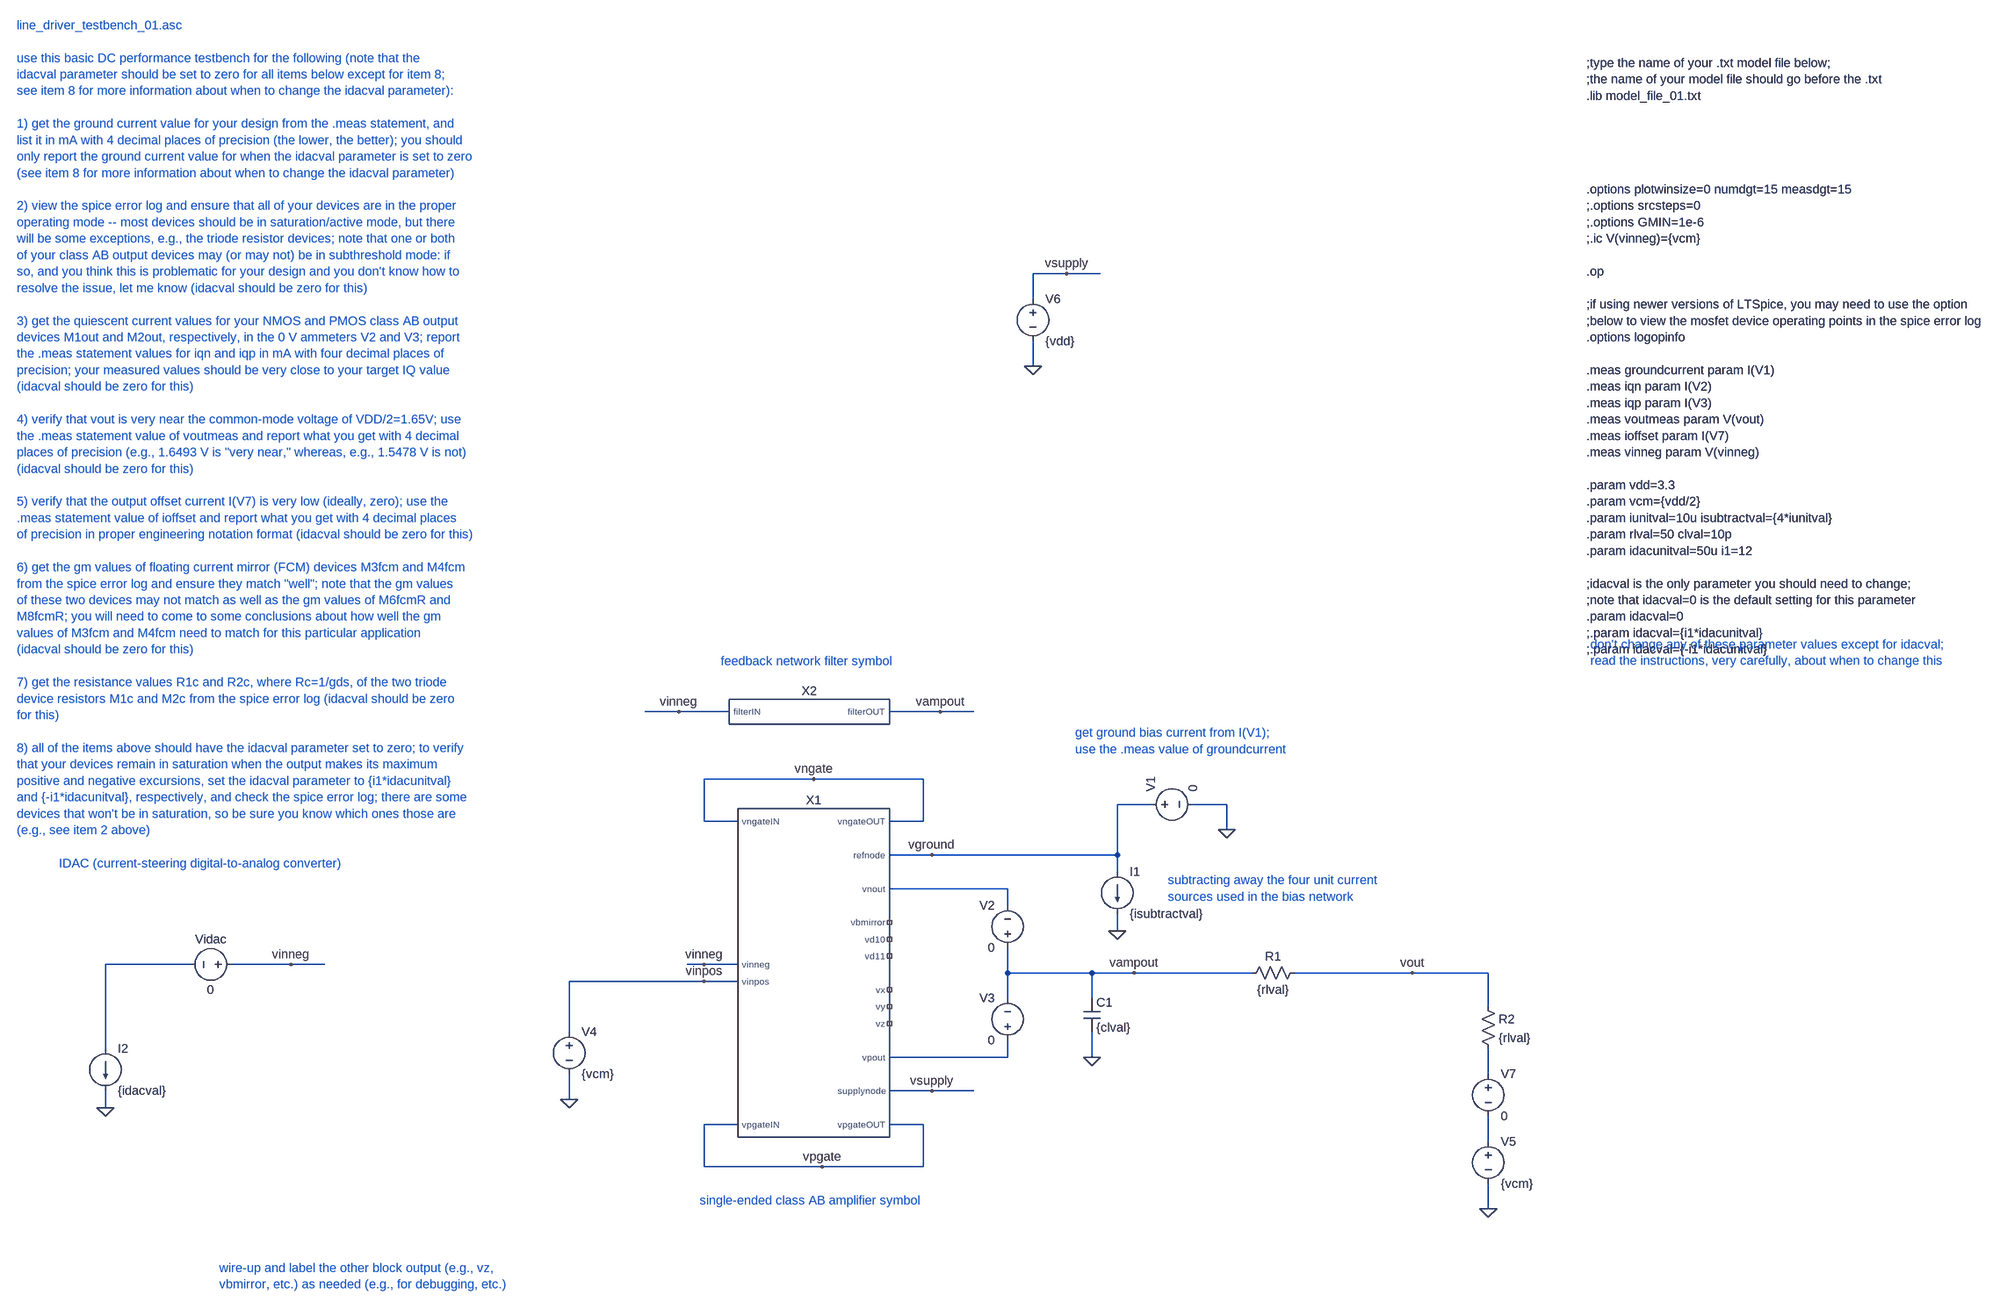
[diagram p0: schematic line_driver_testbench_01.asc]
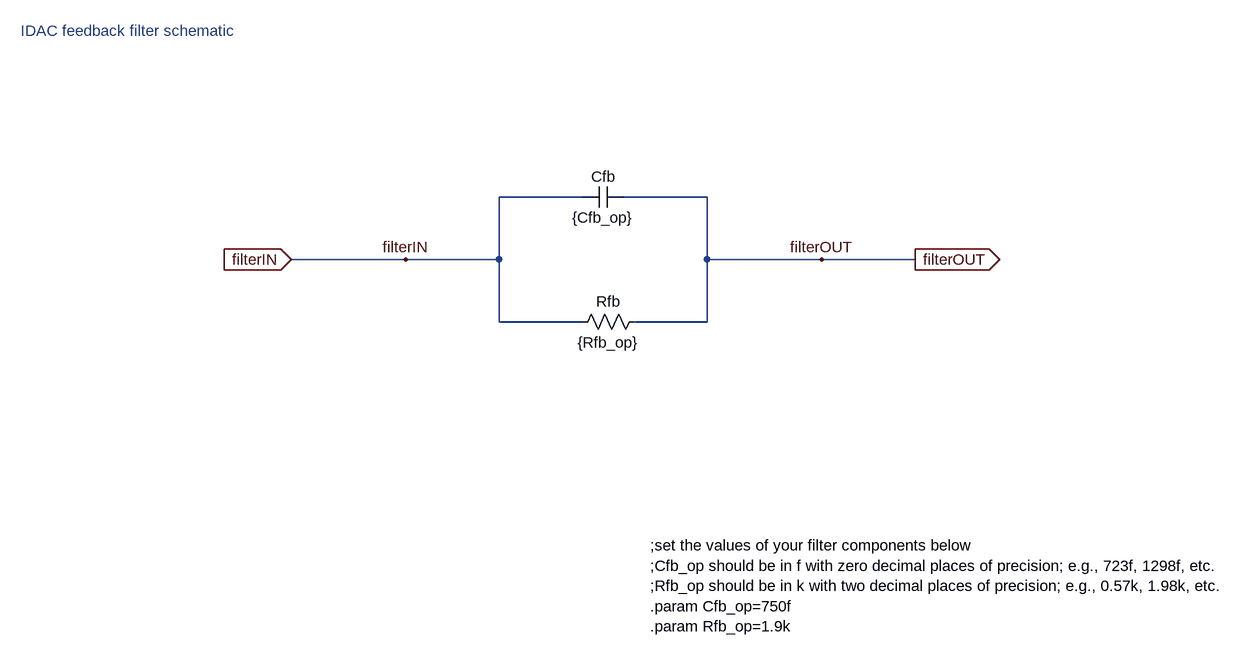
[diagram p1: sub-circuit fdbk_filter_schematic.asc]
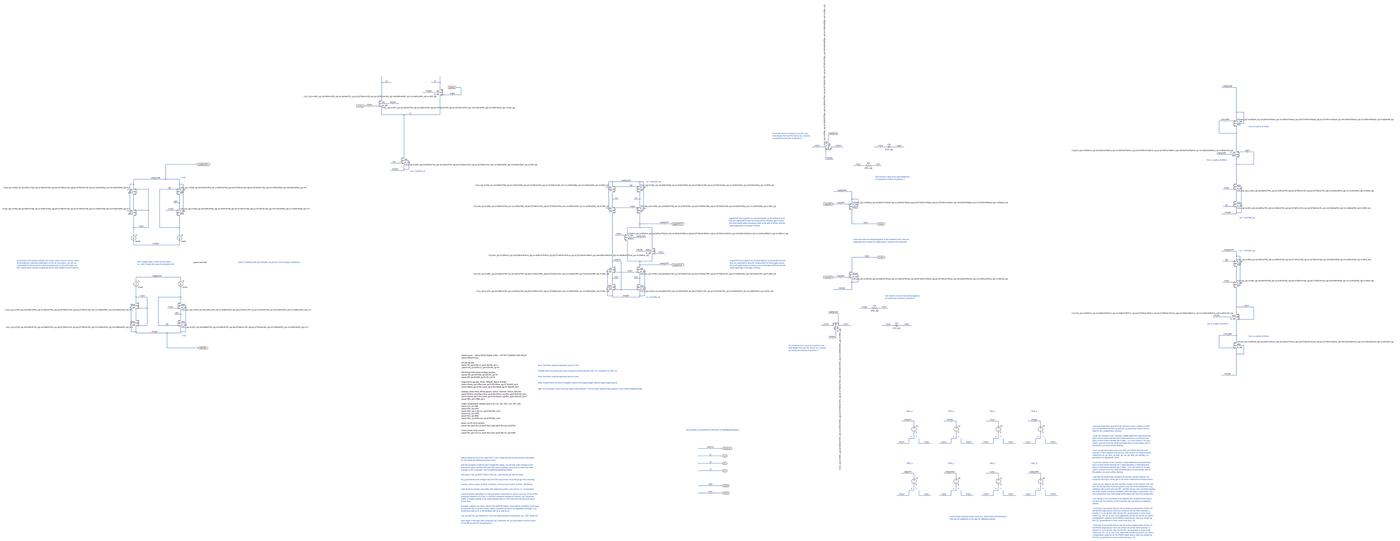
[diagram p2: sub-circuit amp_schematic_typeb_nmos_diff_pair.asc, whole sheet]
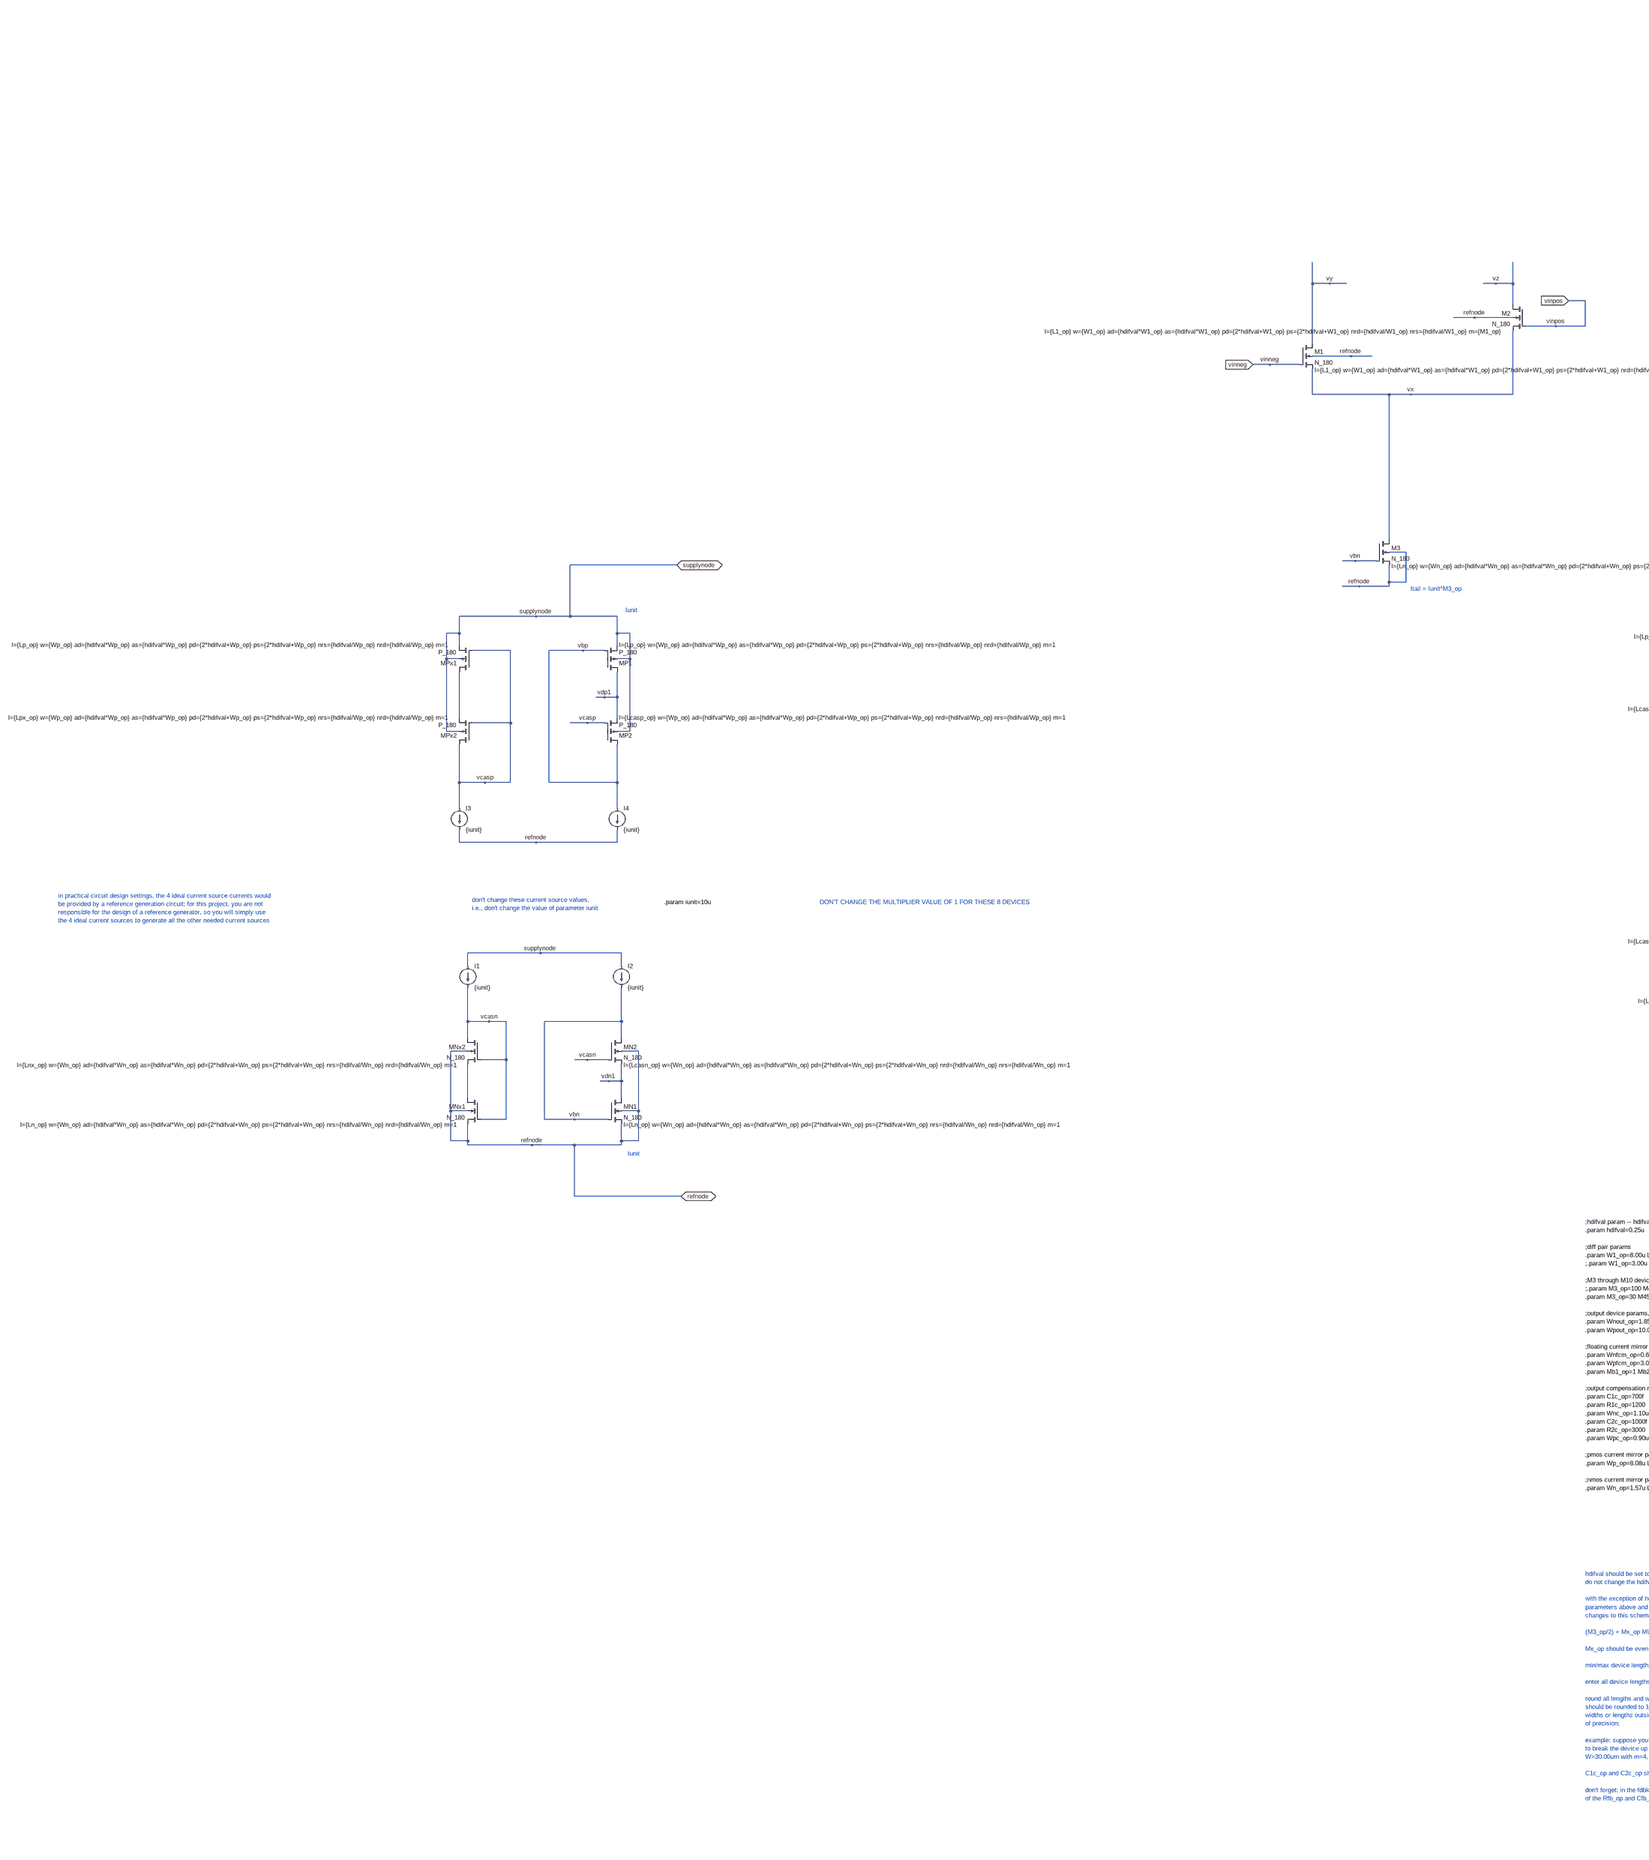
[diagram p3: sub-circuit amp_schematic_typeb_nmos_diff_pair.asc, part, row 1 of 1, column 1 of 3]
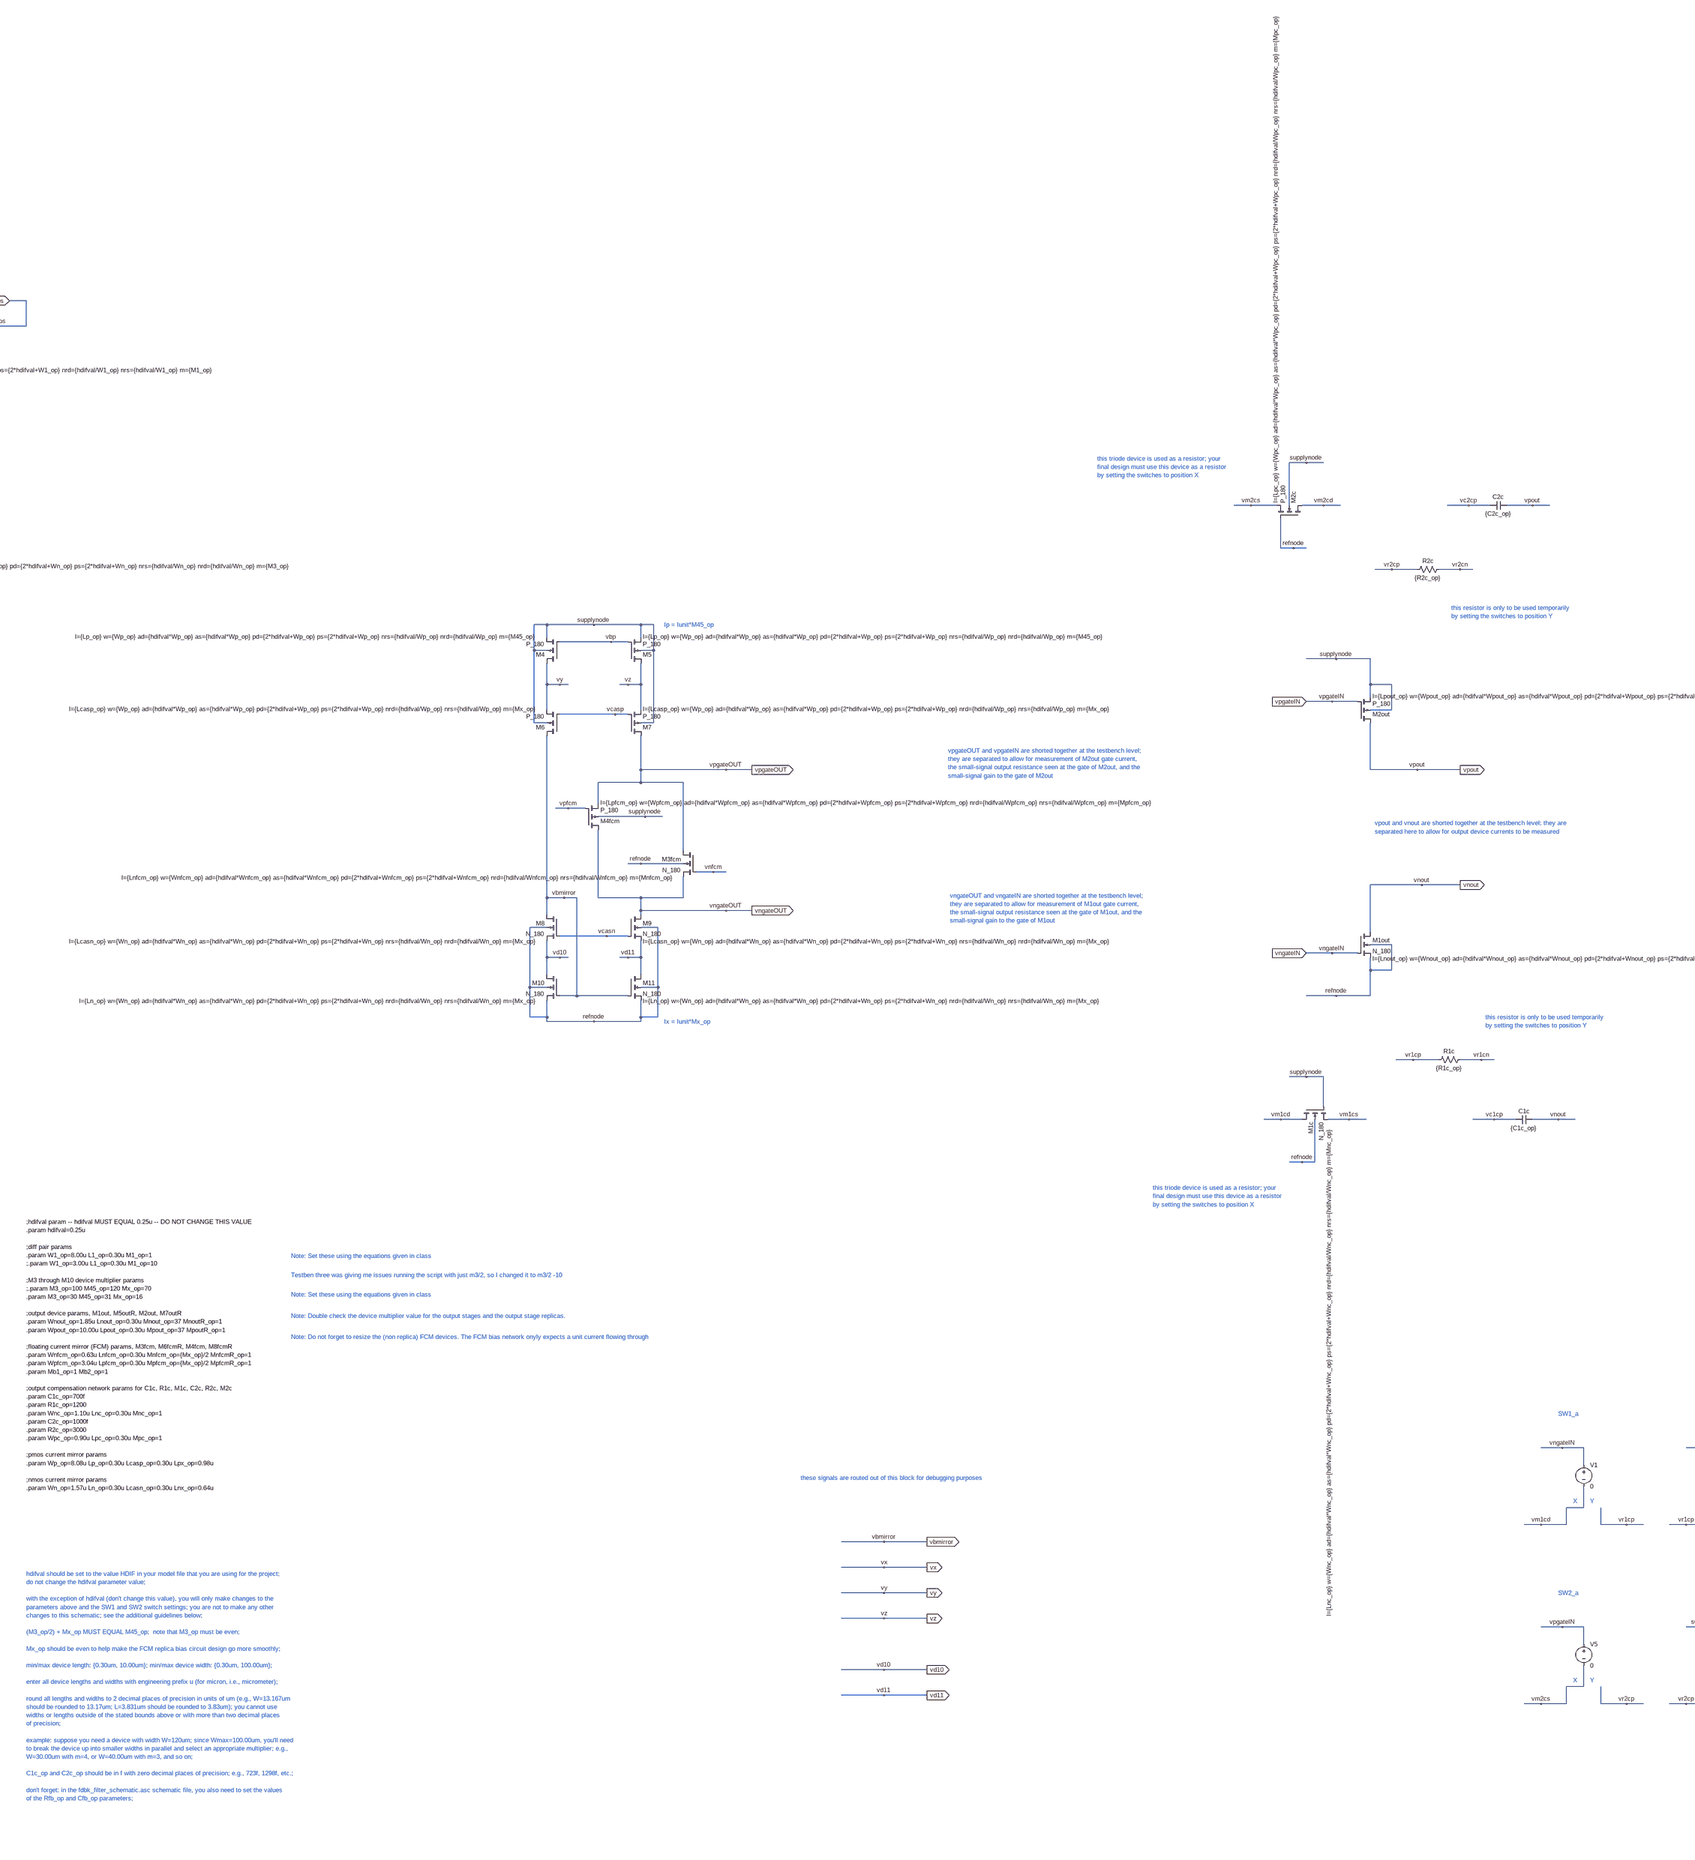
[diagram p4: sub-circuit amp_schematic_typeb_nmos_diff_pair.asc, part, row 1 of 1, column 2 of 3]
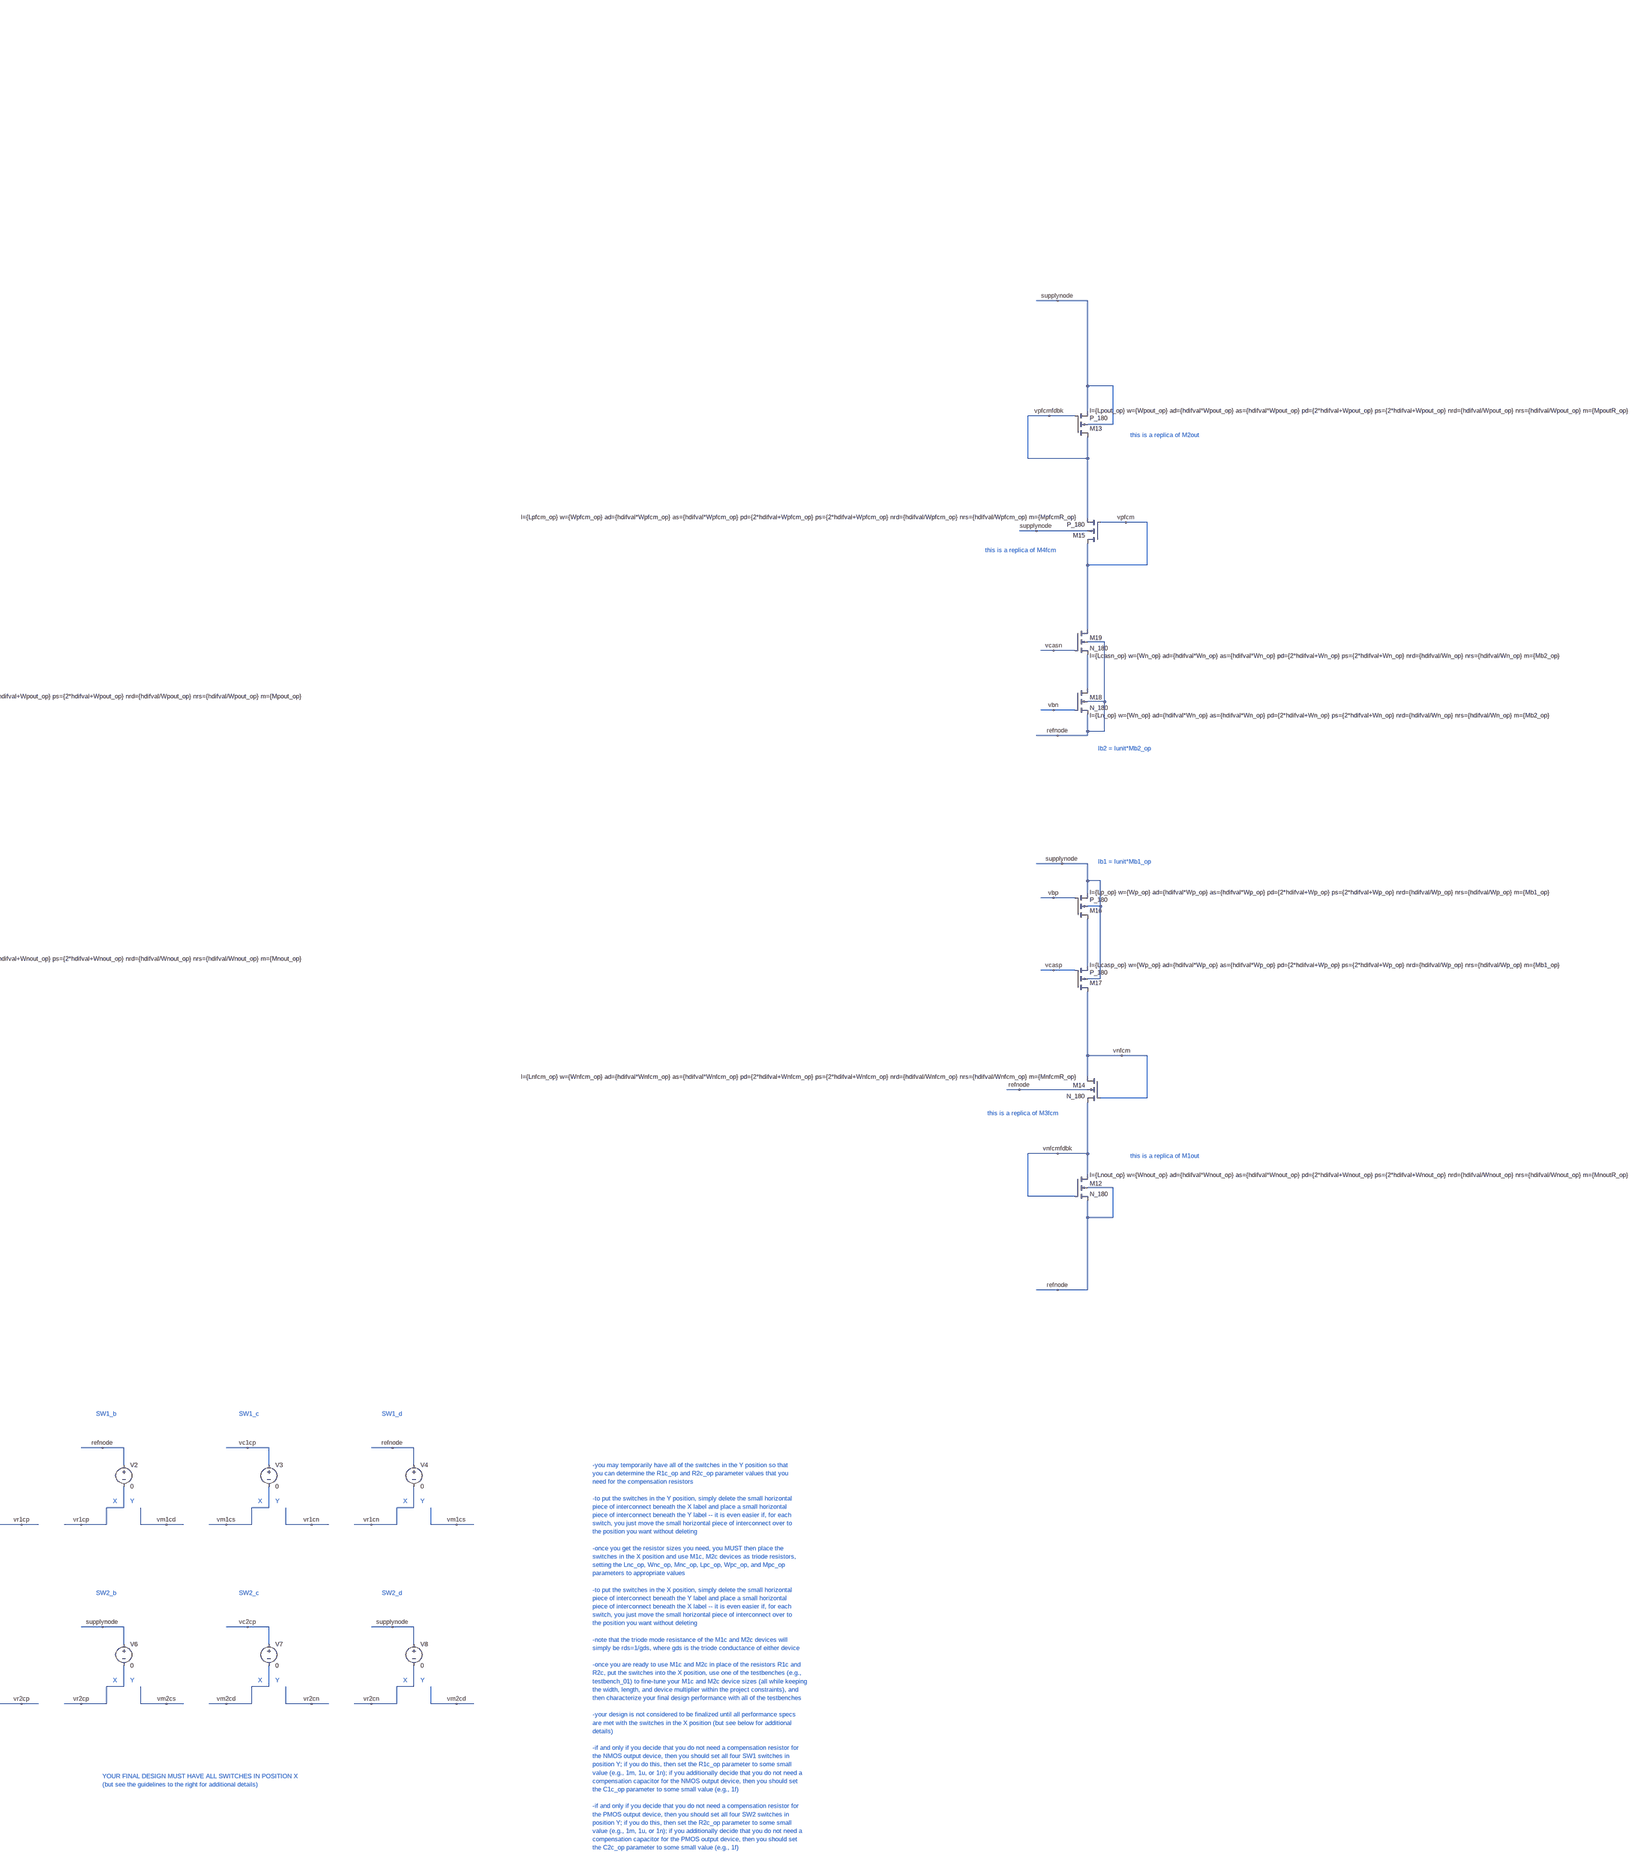
[diagram p5: sub-circuit amp_schematic_typeb_nmos_diff_pair.asc, part, row 1 of 1, column 3 of 3]
line_driver_testbench_01.asc, the LTspice schematic file:
Version 4.1
SHEET 1 5736 4800
WIRE -272 -1360 -336 -1360
WIRE -208 -1360 -272 -1360
WIRE -336 -1312 -336 -1360
WIRE -336 -1184 -336 -1232
WIRE -1008 -528 -1072 -528
WIRE -912 -528 -1008 -528
WIRE -512 -528 -608 -528
WIRE -448 -528 -512 -528
WIRE -752 -400 -960 -400
WIRE -544 -400 -752 -400
WIRE -112 -352 -176 -352
WIRE 32 -352 -32 -352
WIRE -960 -320 -960 -400
WIRE -896 -320 -960 -320
WIRE -544 -320 -544 -400
WIRE -544 -320 -608 -320
WIRE 32 -304 32 -352
WIRE -528 -256 -608 -256
WIRE -176 -256 -176 -352
WIRE -176 -256 -528 -256
WIRE -176 -224 -176 -256
WIRE -384 -192 -608 -192
WIRE -384 -160 -384 -192
WIRE -176 -112 -176 -144
WIRE -1936 -48 -2096 -48
WIRE -1744 -48 -1856 -48
WIRE -1680 -48 -1744 -48
WIRE -960 -48 -992 -48
WIRE -896 -48 -960 -48
WIRE -384 -32 -384 -80
WIRE -224 -32 -384 -32
WIRE -144 -32 -224 -32
WIRE 80 -32 -144 -32
WIRE 384 -32 160 -32
WIRE 528 -32 384 -32
WIRE -960 -16 -1216 -16
WIRE -896 -16 -960 -16
WIRE -384 16 -384 -32
WIRE -224 16 -224 -32
WIRE 528 32 528 -32
WIRE -1216 80 -1216 -16
WIRE -2096 112 -2096 -48
WIRE -384 128 -384 96
WIRE -384 128 -608 128
WIRE -224 128 -224 80
WIRE 528 160 528 112
WIRE -528 192 -608 192
WIRE -448 192 -528 192
WIRE -1216 208 -1216 160
WIRE -2096 224 -2096 192
WIRE -896 256 -960 256
WIRE -544 256 -608 256
WIRE 528 288 528 240
WIRE -960 336 -960 256
WIRE -736 336 -960 336
WIRE -544 336 -544 256
WIRE -544 336 -736 336
WIRE 528 416 528 368
FLAG 32 -304 0
FLAG -528 192 vsupply
FLAG -960 -48 vinneg
FLAG -960 -16 vinpos
FLAG -528 -256 vground
FLAG -176 -112 0
FLAG -144 -32 vampout
FLAG -336 -1184 0
FLAG 528 416 0
FLAG -1216 208 0
FLAG -272 -1360 vsupply
FLAG 384 -32 vout
FLAG -512 -528 vampout
FLAG -1008 -528 vinneg
FLAG -752 -400 vngate
FLAG -736 336 vpgate
FLAG -2096 224 0
FLAG -1744 -48 vinneg
FLAG -224 128 0
DATAFLAG -528 -192 ""
DATAFLAG -528 128 ""
SYMBOL voltage -128 -352 R270
WINDOW 123 0 0 Left 0
WINDOW 39 0 0 Left 0
SYMATTR InstName V1
SYMATTR Value 0
SYMBOL current -176 -224 R0
WINDOW 123 0 0 Left 0
WINDOW 39 0 0 Left 0
SYMATTR InstName I1
SYMATTR Value {isubtractval}
SYMBOL voltage -384 -64 R180
WINDOW 0 24 96 Left 2
WINDOW 3 24 16 Left 2
WINDOW 123 0 0 Left 0
WINDOW 39 0 0 Left 0
SYMATTR InstName V2
SYMATTR Value 0
SYMBOL voltage -384 112 R180
WINDOW 0 24 96 Left 2
WINDOW 3 24 16 Left 2
WINDOW 123 0 0 Left 0
WINDOW 39 0 0 Left 0
SYMATTR InstName V3
SYMATTR Value 0
SYMBOL voltage -1216 64 R0
WINDOW 123 0 0 Left 0
WINDOW 39 0 0 Left 0
SYMATTR InstName V4
SYMATTR Value {vcm}
SYMBOL voltage 528 272 R0
WINDOW 123 0 0 Left 0
WINDOW 39 0 0 Left 0
SYMATTR InstName V5
SYMATTR Value {vcm}
SYMBOL voltage -336 -1328 R0
WINDOW 123 0 0 Left 0
WINDOW 39 0 0 Left 0
SYMATTR InstName V6
SYMATTR Value {vdd}
SYMBOL res 176 -48 R90
WINDOW 0 0 56 VBottom 2
WINDOW 3 32 56 VTop 2
SYMATTR InstName R1
SYMATTR Value {rlval}
SYMBOL res 512 16 R0
SYMATTR InstName R2
SYMATTR Value {rlval}
SYMBOL fdbk_filter_schematic -768 -528 R0
SYMATTR InstName X2
SYMBOL voltage 528 144 R0
WINDOW 123 0 0 Left 0
WINDOW 39 0 0 Left 0
SYMATTR InstName V7
SYMATTR Value 0
SYMBOL current -2096 112 R0
WINDOW 123 0 0 Left 0
WINDOW 39 0 0 Left 0
SYMATTR InstName I2
SYMATTR Value {idacval}
SYMBOL voltage -1840 -48 R90
WINDOW 0 -32 56 VBottom 2
WINDOW 3 32 56 VTop 2
SYMATTR InstName Vidac
SYMATTR Value 0
SYMBOL cap -240 16 R0
SYMATTR InstName C1
SYMATTR Value {clval}
SYMBOL amp_schematic_typeB_nmos_diff_pair -752 -32 R0
SYMATTR InstName X1
TEXT -1880 528 Left 2 ;wire-up and label the other block output (e.g., vz,\nvbmirror, etc.) as needed (e.g., for debugging, etc.)
TEXT -968 400 Left 2 ;single-ended class AB amplifier symbol
TEXT -256 -488 Left 2 ;get ground bias current from I(V1);\nuse the .meas value of groundcurrent
TEXT 1144 -1520 Left 2 !.options plotwinsize=0 numdgt=15 measdgt=15\n;.options srcsteps=0\n;.options GMIN=1e-6\n;.ic V(vinneg)={vcm}\n \n.op\n \n;if using newer versions of LTSpice, you may need to use the option \n;below to view the mosfet device operating points in the spice error log\n.options logopinfo\n \n.meas groundcurrent param I(V1)\n.meas iqn param I(V2)\n.meas iqp param I(V3)\n.meas voutmeas param V(vout)\n.meas ioffset param I(V7)\n.meas vinneg param V(vinneg)\n \n.param vdd=3.3\n.param vcm={vdd/2}\n.param iunitval=10u isubtractval={4*iunitval}\n.param rlval=50 clval=10p\n.param idacunitval=50u i1=12\n \n;idacval is the only parameter you should need to change;\n;note that idacval=0 is the default setting for this parameter\n.param idacval=0\n;.param idacval={i1*idacunitval}\n;.param idacval={-i1*idacunitval}
TEXT -80 -208 Left 2 ;subtracting away the four unit current \nsources used in the bias network
TEXT 1152 -656 Left 2 ;don't change any of these parameter values except for idacval;\nread the instructions, very carefully, about when to change this
TEXT 1144 -1760 Left 2 !;type the name of your .txt model file below;\n;the name of your model file should go before the .txt\n.lib model_file_01.txt
TEXT -2264 -1832 Left 2 ;line_driver_testbench_01.asc\n \nuse this basic DC performance testbench for the following (note that the \nidacval parameter should be set to zero for all items below except for item 8; \nsee item 8 for more information about when to change the idacval parameter):\n \n1) get the ground current value for your design from the .meas statement, and \nlist it in mA with 4 decimal places of precision (the lower, the better); you should\nonly report the ground current value for when the idacval parameter is set to zero\n(see item 8 for more information about when to change the idacval parameter)\n \n2) view the spice error log and ensure that all of your devices are in the proper\noperating mode -- most devices should be in saturation/active mode, but there\nwill be some exceptions, e.g., the triode resistor devices; note that one or both \nof your class AB output devices may (or may not) be in subthreshold mode: if \nso, and you think this is problematic for your design and you don't know how to\nresolve the issue, let me know (idacval should be zero for this)\n \n3) get the quiescent current values for your NMOS and PMOS class AB output\ndevices M1out and M2out, respectively, in the 0 V ammeters V2 and V3; report\nthe .meas statement values for iqn and iqp in mA with four decimal places of\nprecision; your measured values should be very close to your target IQ value\n(idacval should be zero for this)\n \n4) verify that vout is very near the common-mode voltage of VDD/2=1.65V; use\nthe .meas statement value of voutmeas and report what you get with 4 decimal\nplaces of precision (e.g., 1.6493 V is "very near," whereas, e.g., 1.5478 V is not)\n(idacval should be zero for this)\n \n5) verify that the output offset current I(V7) is very low (ideally, zero); use the \n.meas statement value of ioffset and report what you get with 4 decimal places \nof precision in proper engineering notation format (idacval should be zero for this)\n \n6) get the gm values of floating current mirror (FCM) devices M3fcm and M4fcm \nfrom the spice error log and ensure they match "well"; note that the gm values\nof these two devices may not match as well as the gm values of M6fcmR and \nM8fcmR; you will need to come to some conclusions about how well the gm\nvalues of M3fcm and M4fcm need to match for this particular application\n(idacval should be zero for this)\n \n7) get the resistance values R1c and R2c, where Rc=1/gds, of the two triode \ndevice resistors M1c and M2c from the spice error log (idacval should be zero \nfor this)\n \n8) all of the items above should have the idacval parameter set to zero; to verify \nthat your devices remain in saturation when the output makes its maximum\npositive and negative excursions, set the idacval parameter to {i1*idacunitval} \nand {-i1*idacunitval}, respectively, and check the spice error log; there are some\ndevices that won't be in saturation, so be sure you know which ones those are\n(e.g., see item 2 above)
TEXT -928 -624 Left 2 ;feedback network filter symbol
TEXT -2184 -240 Left 2 ;IDAC (current-steering digital-to-analog converter)

The netlist it stands for:
* line_driver_testbench_01.asc
V1 vground 0 0
I1 vground 0 {isubtractval}
V2 vampout N001 0
V3 N003 vampout 0
V4 vinpos 0 {vcm}
V5 N005 0 {vcm}
V6 vsupply 0 {vdd}
R1 vout vampout {rlval}
R2 vout N004 {rlval}
X§X2 vinneg vampout fdbk_filter_schematic
V7 N004 N005 0
I2 N002 0 {idacval}
Vidac vinneg N002 0
C1 vampout 0 {clval}
X§X1 vinneg vinpos vngate vpgate vground vsupply NC_01 NC_02 NC_03 vngate N001 vpgate N003 NC_04 NC_05 NC_06 amp_schematic_typeb_nmos_diff_pair

* block symbol definitions
.subckt fdbk_filter_schematic filterIN filterOUT
Cfb filterOUT filterIN {Cfb_op}
Rfb filterOUT filterIN {Rfb_op}
* IDAC feedback filter schematic
;set the values of your filter components below
;Cfb_op should be in f with zero decimal places of precision; e.g., 723f, 1298f, etc.
;Rfb_op should be in k with two decimal places of precision; e.g., 0.57k, 1.98k, etc.
.param Cfb_op=750f
.param Rfb_op=1.9k
.ends fdbk_filter_schematic

.subckt amp_schematic_typeb_nmos_diff_pair vinneg vinpos vngateIN vpgateIN refnode supplynode vbmirror vd10 vd11 vngateOUT vnout vpgateOUT vpout vx vy vz
MN1 vdn1 vbn refnode refnode N_180 l={Ln_op} w={Wn_op} ad={hdifval*Wn_op} as={hdifval*Wn_op} pd={2*hdifval+Wn_op} ps={2*hdifval+Wn_op} nrs={hdifval/Wn_op} nrd={hdifval/Wn_op} m=1
MN2 vbn vcasn vdn1 refnode N_180 l={Lcasn_op} w={Wn_op} ad={hdifval*Wn_op} as={hdifval*Wn_op} pd={2*hdifval+Wn_op} ps={2*hdifval+Wn_op} nrd={hdifval/Wn_op} nrs={hdifval/Wn_op} m=1
MNx1 N004 vcasn refnode refnode N_180 l={Ln_op} w={Wn_op} ad={hdifval*Wn_op} as={hdifval*Wn_op} pd={2*hdifval+Wn_op} ps={2*hdifval+Wn_op} nrs={hdifval/Wn_op} nrd={hdifval/Wn_op} m=1
MNx2 vcasn vcasn N004 refnode N_180 l={Lnx_op} w={Wn_op} ad={hdifval*Wn_op} as={hdifval*Wn_op} pd={2*hdifval+Wn_op} ps={2*hdifval+Wn_op} nrs={hdifval/Wn_op} nrd={hdifval/Wn_op} m=1
MP1 vdp1 vbp supplynode supplynode P_180 l={Lp_op} w={Wp_op} ad={hdifval*Wp_op} as={hdifval*Wp_op} pd={2*hdifval+Wp_op} ps={2*hdifval+Wp_op} nrs={hdifval/Wp_op} nrd={hdifval/Wp_op} m=1
MP2 vbp vcasp vdp1 supplynode P_180 l={Lcasp_op} w={Wp_op} ad={hdifval*Wp_op} as={hdifval*Wp_op} pd={2*hdifval+Wp_op} ps={2*hdifval+Wp_op} nrd={hdifval/Wp_op} nrs={hdifval/Wp_op} m=1
MPx1 N002 vcasp supplynode supplynode P_180 l={Lp_op} w={Wp_op} ad={hdifval*Wp_op} as={hdifval*Wp_op} pd={2*hdifval+Wp_op} ps={2*hdifval+Wp_op} nrs={hdifval/Wp_op} nrd={hdifval/Wp_op} m=1
MPx2 vcasp vcasp N002 supplynode P_180 l={Lpx_op} w={Wp_op} ad={hdifval*Wp_op} as={hdifval*Wp_op} pd={2*hdifval+Wp_op} ps={2*hdifval+Wp_op} nrs={hdifval/Wp_op} nrd={hdifval/Wp_op} m=1
I1 supplynode vcasn {iunit}
I2 supplynode vbn {iunit}
I3 vcasp refnode {iunit}
I4 vbp refnode {iunit}
M11 vd11 vbmirror refnode refnode N_180 l={Ln_op} w={Wn_op} ad={hdifval*Wn_op} as={hdifval*Wn_op} pd={2*hdifval+Wn_op} ps={2*hdifval+Wn_op} nrd={hdifval/Wn_op} nrs={hdifval/Wn_op} m={Mx_op}
M9 vngateOUT vcasn vd11 refnode N_180 l={Lcasn_op} w={Wn_op} ad={hdifval*Wn_op} as={hdifval*Wn_op} pd={2*hdifval+Wn_op} ps={2*hdifval+Wn_op} nrs={hdifval/Wn_op} nrd={hdifval/Wn_op} m={Mx_op}
M10 vd10 vbmirror refnode refnode N_180 l={Ln_op} w={Wn_op} ad={hdifval*Wn_op} as={hdifval*Wn_op} pd={2*hdifval+Wn_op} ps={2*hdifval+Wn_op} nrd={hdifval/Wn_op} nrs={hdifval/Wn_op} m={Mx_op}
M8 vbmirror vcasn vd10 refnode N_180 l={Lcasn_op} w={Wn_op} ad={hdifval*Wn_op} as={hdifval*Wn_op} pd={2*hdifval+Wn_op} ps={2*hdifval+Wn_op} nrs={hdifval/Wn_op} nrd={hdifval/Wn_op} m={Mx_op}
M5 vz vbp supplynode supplynode P_180 l={Lp_op} w={Wp_op} ad={hdifval*Wp_op} as={hdifval*Wp_op} pd={2*hdifval+Wp_op} ps={2*hdifval+Wp_op} nrs={hdifval/Wp_op} nrd={hdifval/Wp_op} m={M45_op}
M7 vpgateOUT vcasp vz supplynode P_180 l={Lcasp_op} w={Wp_op} ad={hdifval*Wp_op} as={hdifval*Wp_op} pd={2*hdifval+Wp_op} ps={2*hdifval+Wp_op} nrd={hdifval/Wp_op} nrs={hdifval/Wp_op} m={Mx_op}
M4 vy vbp supplynode supplynode P_180 l={Lp_op} w={Wp_op} ad={hdifval*Wp_op} as={hdifval*Wp_op} pd={2*hdifval+Wp_op} ps={2*hdifval+Wp_op} nrs={hdifval/Wp_op} nrd={hdifval/Wp_op} m={M45_op}
M6 vbmirror vcasp vy supplynode P_180 l={Lcasp_op} w={Wp_op} ad={hdifval*Wp_op} as={hdifval*Wp_op} pd={2*hdifval+Wp_op} ps={2*hdifval+Wp_op} nrd={hdifval/Wp_op} nrs={hdifval/Wp_op} m={Mx_op}
M3fcm vpgateOUT vnfcm vngateOUT refnode N_180 l={Lnfcm_op} w={Wnfcm_op} ad={hdifval*Wnfcm_op} as={hdifval*Wnfcm_op} pd={2*hdifval+Wnfcm_op} ps={2*hdifval+Wnfcm_op} nrd={hdifval/Wnfcm_op} nrs={hdifval/Wnfcm_op} m={Mnfcm_op}
M4fcm vngateOUT vpfcm vpgateOUT supplynode P_180 l={Lpfcm_op} w={Wpfcm_op} ad={hdifval*Wpfcm_op} as={hdifval*Wpfcm_op} pd={2*hdifval+Wpfcm_op} ps={2*hdifval+Wpfcm_op} nrd={hdifval/Wpfcm_op} nrs={hdifval/Wpfcm_op} m={Mpfcm_op}
M1out vnout vngateIN refnode refnode N_180 l={Lnout_op} w={Wnout_op} ad={hdifval*Wnout_op} as={hdifval*Wnout_op} pd={2*hdifval+Wnout_op} ps={2*hdifval+Wnout_op} nrd={hdifval/Wnout_op} nrs={hdifval/Wnout_op} m={Mnout_op}
M2out vpout vpgateIN supplynode supplynode P_180 l={Lpout_op} w={Wpout_op} ad={hdifval*Wpout_op} as={hdifval*Wpout_op} pd={2*hdifval+Wpout_op} ps={2*hdifval+Wpout_op} nrd={hdifval/Wpout_op} nrs={hdifval/Wpout_op} m={Mpout_op}
M1 vy vinneg vx refnode N_180 l={L1_op} w={W1_op} ad={hdifval*W1_op} as={hdifval*W1_op} pd={2*hdifval+W1_op} ps={2*hdifval+W1_op} nrd={hdifval/W1_op} nrs={hdifval/W1_op} m={M1_op}
M2 vz vinpos vx refnode N_180 l={L1_op} w={W1_op} ad={hdifval*W1_op} as={hdifval*W1_op} pd={2*hdifval+W1_op} ps={2*hdifval+W1_op} nrd={hdifval/W1_op} nrs={hdifval/W1_op} m={M1_op}
M3 vx vbn refnode refnode N_180 l={Ln_op} w={Wn_op} ad={hdifval*Wn_op} as={hdifval*Wn_op} pd={2*hdifval+Wn_op} ps={2*hdifval+Wn_op} nrs={hdifval/Wn_op} nrd={hdifval/Wn_op} m={M3_op}
V1 vngateIN vm1cd 0
V2 refnode vr1cp 0
V3 vc1cp vm1cs 0
V4 refnode vr1cn 0
V5 vpgateIN vm2cs 0
V6 supplynode vr2cp 0
V7 vc2cp vm2cd 0
V8 supplynode vr2cn 0
C1c vnout vc1cp {C1c_op}
M1c vm1cd supplynode vm1cs refnode N_180 l={Lnc_op} w={Wnc_op} ad={hdifval*Wnc_op} as={hdifval*Wnc_op} pd={2*hdifval+Wnc_op} ps={2*hdifval+Wnc_op} nrd={hdifval/Wnc_op} nrs={hdifval/Wnc_op} m={Mnc_op}
R1c vr1cn vr1cp {R1c_op}
C2c vpout vc2cp {C2c_op}
R2c vr2cn vr2cp {R2c_op}
M2c vm2cd refnode vm2cs supplynode P_180 l={Lpc_op} w={Wpc_op} ad={hdifval*Wpc_op} as={hdifval*Wpc_op} pd={2*hdifval+Wpc_op} ps={2*hdifval+Wpc_op} nrd={hdifval/Wpc_op} nrs={hdifval/Wpc_op} m={Mpc_op}
M12 vnfcmfdbk vnfcmfdbk refnode refnode N_180 l={Lnout_op} w={Wnout_op} ad={hdifval*Wnout_op} as={hdifval*Wnout_op} pd={2*hdifval+Wnout_op} ps={2*hdifval+Wnout_op} nrd={hdifval/Wnout_op} nrs={hdifval/Wnout_op} m={MnoutR_op}
M13 vpfcmfdbk vpfcmfdbk supplynode supplynode P_180 l={Lpout_op} w={Wpout_op} ad={hdifval*Wpout_op} as={hdifval*Wpout_op} pd={2*hdifval+Wpout_op} ps={2*hdifval+Wpout_op} nrd={hdifval/Wpout_op} nrs={hdifval/Wpout_op} m={MpoutR_op}
M14 vnfcm vnfcm vnfcmfdbk refnode N_180 l={Lnfcm_op} w={Wnfcm_op} ad={hdifval*Wnfcm_op} as={hdifval*Wnfcm_op} pd={2*hdifval+Wnfcm_op} ps={2*hdifval+Wnfcm_op} nrd={hdifval/Wnfcm_op} nrs={hdifval/Wnfcm_op} m={MnfcmR_op}
M15 vpfcm vpfcm vpfcmfdbk supplynode P_180 l={Lpfcm_op} w={Wpfcm_op} ad={hdifval*Wpfcm_op} as={hdifval*Wpfcm_op} pd={2*hdifval+Wpfcm_op} ps={2*hdifval+Wpfcm_op} nrd={hdifval/Wpfcm_op} nrs={hdifval/Wpfcm_op} m={MpfcmR_op}
M16 N003 vbp supplynode supplynode P_180 l={Lp_op} w={Wp_op} ad={hdifval*Wp_op} as={hdifval*Wp_op} pd={2*hdifval+Wp_op} ps={2*hdifval+Wp_op} nrd={hdifval/Wp_op} nrs={hdifval/Wp_op} m={Mb1_op}
M17 vnfcm vcasp N003 supplynode P_180 l={Lcasp_op} w={Wp_op} ad={hdifval*Wp_op} as={hdifval*Wp_op} pd={2*hdifval+Wp_op} ps={2*hdifval+Wp_op} nrd={hdifval/Wp_op} nrs={hdifval/Wp_op} m={Mb1_op}
M18 N001 vbn refnode refnode N_180 l={Ln_op} w={Wn_op} ad={hdifval*Wn_op} as={hdifval*Wn_op} pd={2*hdifval+Wn_op} ps={2*hdifval+Wn_op} nrd={hdifval/Wn_op} nrs={hdifval/Wn_op} m={Mb2_op}
M19 vpfcm vcasn N001 refnode N_180 l={Lcasn_op} w={Wn_op} ad={hdifval*Wn_op} as={hdifval*Wn_op} pd={2*hdifval+Wn_op} ps={2*hdifval+Wn_op} nrd={hdifval/Wn_op} nrs={hdifval/Wn_op} m={Mb2_op}
;hdifval param -- hdifval MUST EQUAL 0.25u -- DO NOT CHANGE THIS VALUE
.param hdifval=0.25u
;diff pair params
.param W1_op=8.00u L1_op=0.30u M1_op=1
;.param W1_op=3.00u L1_op=0.30u M1_op=10
;M3 through M10 device multiplier params
;.param M3_op=100 M45_op=120 Mx_op=70
.param M3_op=30 M45_op=31 Mx_op=16
;output device params, M1out, M5outR, M2out, M7outR
.param Wnout_op=1.85u Lnout_op=0.30u Mnout_op=37 MnoutR_op=1
.param Wpout_op=10.00u Lpout_op=0.30u Mpout_op=37 MpoutR_op=1
;floating current mirror (FCM) params, M3fcm, M6fcmR, M4fcm, M8fcmR
.param Wnfcm_op=0.63u Lnfcm_op=0.30u Mnfcm_op={Mx_op}/2 MnfcmR_op=1
.param Wpfcm_op=3.04u Lpfcm_op=0.30u Mpfcm_op={Mx_op}/2 MpfcmR_op=1
.param Mb1_op=1 Mb2_op=1
;output compensation network params for C1c, R1c, M1c, C2c, R2c, M2c
.param C1c_op=700f
.param R1c_op=1200
.param Wnc_op=1.10u Lnc_op=0.30u Mnc_op=1
.param C2c_op=1000f
.param R2c_op=3000
.param Wpc_op=0.90u Lpc_op=0.30u Mpc_op=1
;pmos current mirror params
.param Wp_op=8.08u Lp_op=0.30u Lcasp_op=0.30u Lpx_op=0.98u
;nmos current mirror params
.param Wn_op=1.57u Ln_op=0.30u Lcasn_op=0.30u Lnx_op=0.64u
* Ip = Iunit*M45_op
* Ix = Iunit*Mx_op
* hdifval should be set to the value HDIF in your model file that you are using for the project;
* do not change the hdifval parameter value;
* with the exception of hdifval (don't change this value), you will only make changes to the
* parameters above and the SW1 and SW2 switch settings; you are not to make any other
* changes to this schematic; see the additional guidelines below;
* (M3_op/2) + Mx_op MUST EQUAL M45_op;  note that M3_op must be even;
* Mx_op should be even to help make the FCM replica bias circuit design go more smoothly;
* min/max device length: {0.30um, 10.00um}; min/max device width: {0.30um, 100.00um};
* enter all device lengths and widths with engineering prefix u (for micron, i.e., micrometer);
* round all lengths and widths to 2 decimal places of precision in units of um (e.g., W=13.167um
* should be rounded to 13.17um; L=3.831um should be rounded to 3.83um); you cannot use
* widths or lengths outside of the stated bounds above or with more than two decimal places
* of precision;
* example: suppose you need a device with width W=120um; since Wmax=100.00um, you'll need
* to break the device up into smaller widths in parallel and select an appropriate multiplier; e.g.,
* W=30.00um with m=4, or W=40.00um with m=3, and so on;
* C1c_op and C2c_op should be in f with zero decimal places of precision; e.g., 723f, 1298f, etc.;
* don't forget: in the fdbk_filter_schematic.asc schematic file, you also need to set the values
* of the Rfb_op and Cfb_op parameters;
* these signals are routed out of this block for debugging purposes
* vpout and vnout are shorted together at the testbench level; they are
* separated here to allow for output device currents to be measured
* don't change these current source values,
* i.e., don't change the value of parameter iunit
* in practical circuit design settings, the 4 ideal current source currents would
* be provided by a reference generation circuit; for this project, you are not
* responsible for the design of a reference generator, so you will simply use
* the 4 ideal current sources to generate all the other needed current sources
* Iunit
* Iunit
* vpgateOUT and vpgateIN are shorted together at the testbench level;
* they are separated to allow for measurement of M2out gate current,
* the small-signal output resistance seen at the gate of M2out, and the
* small-signal gain to the gate of M2out
* vngateOUT and vngateIN are shorted together at the testbench level;
* they are separated to allow for measurement of M1out gate current,
* the small-signal output resistance seen at the gate of M1out, and the
* small-signal gain to the gate of M1out
* Itail = Iunit*M3_op
.param iunit=10u
* X
* Y
* SW1_a
* SW1_b
* SW1_c
* SW1_d
* X
* Y
* X
* Y
* X
* Y
* X
* Y
* SW2_a
* SW2_b
* SW2_c
* SW2_d
* X
* Y
* X
* Y
* X
* Y
* -you may temporarily have all of the switches in the Y position so that
* you can determine the R1c_op and R2c_op parameter values that you
* need for the compensation resistors
* -to put the switches in the Y position, simply delete the small horizontal
* piece of interconnect beneath the X label and place a small horizontal
* piece of interconnect beneath the Y label -- it is even easier if, for each
* switch, you just move the small horizontal piece of interconnect over to
* the position you want without deleting
* -once you get the resistor sizes you need, you MUST then place the
* switches in the X position and use M1c, M2c devices as triode resistors,
* setting the Lnc_op, Wnc_op, Mnc_op, Lpc_op, Wpc_op, and Mpc_op
* parameters to appropriate values
* -to put the switches in the X position, simply delete the small horizontal
* piece of interconnect beneath the Y label and place a small horizontal
* piece of interconnect beneath the X label -- it is even easier if, for each
* switch, you just move the small horizontal piece of interconnect over to
* the position you want without deleting
* -note that the triode mode resistance of the M1c and M2c devices will
* simply be rds=1/gds, where gds is the triode conductance of either device
* -once you are ready to use M1c and M2c in place of the resistors R1c and
* R2c, put the switches into the X position, use one of the testbenches (e.g.,
* testbench_01) to fine-tune your M1c and M2c device sizes (all while keeping
* the width, length, and device multiplier within the project constraints), and
* then characterize your final design performance with all of the testbenches
* -your design is not considered to be finalized until all performance specs
* are met with the switches in the X position (but see below for additional
* details)
* -if and only if you decide that you do not need a compensation resistor for
* the NMOS output device, then you should set all four SW1 switches in
* position Y; if you do this, then set the R1c_op parameter to some small
* value (e.g., 1m, 1u, or 1n); if you additionally decide that you do not need a
* compensation capacitor for the NMOS output device, then you should set
* the C1c_op parameter to some small value (e.g., 1f)
* -if and only if you decide that you do not need a compensation resistor for
* the PMOS output device, then you should set all four SW2 switches in
* position Y; if you do this, then set the R2c_op parameter to some small
* value (e.g., 1m, 1u, or 1n); if you additionally decide that you do not need a
* compensation capacitor for the PMOS output device, then you should set
* the C2c_op parameter to some small value (e.g., 1f)
* YOUR FINAL DESIGN MUST HAVE ALL SWITCHES IN POSITION X
* (but see the guidelines to the right for additional details)
* this triode device is used as a resistor; your
* final design must use this device as a resistor
* by setting the switches to position X
* this resistor is only to be used temporarily
* by setting the switches to position Y
* this triode device is used as a resistor; your
* final design must use this device as a resistor
* by setting the switches to position X
* this resistor is only to be used temporarily
* by setting the switches to position Y
* this is a replica of M2out
* this is a replica of M1out
* this is a replica of M4fcm
* this is a replica of M3fcm
* Ib2 = Iunit*Mb2_op
* Ib1 = Iunit*Mb1_op
* DON'T CHANGE THE MULTIPLIER VALUE OF 1 FOR THESE 8 DEVICES
* Note: Do not forget to resize the (non replica) FCM devices. The FCM bias network onyly expects a unit current flowing through
* Note: Double check the device multiplier value for the output stages and the output stage replicas.
* Note: Set these using the equations given in class
* Note: Set these using the equations given in class
* Testben three was giving me issues running the script with just m3/2, so I changed it to m3/2 -10
.ends amp_schematic_typeb_nmos_diff_pair

.model NMOS NMOS
.model PMOS PMOS
.lib standard.mos
* wire-up and label the other block output (e.g., vz,
* vbmirror, etc.) as needed (e.g., for debugging, etc.)
* single-ended class AB amplifier symbol
* get ground bias current from I(V1);
* use the .meas value of groundcurrent
.options plotwinsize=0 numdgt=15 measdgt=15
;.options srcsteps=0
;.options GMIN=1e-6
;.ic V(vinneg)={vcm}
.op
;if using newer versions of LTSpice, you may need to use the option
;below to view the mosfet device operating points in the spice error log
.options logopinfo
.meas groundcurrent param I(V1)
.meas iqn param I(V2)
.meas iqp param I(V3)
.meas voutmeas param V(vout)
.meas ioffset param I(V7)
.meas vinneg param V(vinneg)
.param vdd=3.3
.param vcm={vdd/2}
.param iunitval=10u isubtractval={4*iunitval}
.param rlval=50 clval=10p
.param idacunitval=50u i1=12
;idacval is the only parameter you should need to change;
;note that idacval=0 is the default setting for this parameter
.param idacval=0
;.param idacval={i1*idacunitval}
;.param idacval={-i1*idacunitval}
* subtracting away the four unit current
* sources used in the bias network
* don't change any of these parameter values except for idacval;
* read the instructions, very carefully, about when to change this
;type the name of your .txt model file below;
;the name of your model file should go before the .txt
.lib model_file_01.txt
* line_driver_testbench_01.asc
* use this basic DC performance testbench for the following (note that the
* idacval parameter should be set to zero for all items below except for item 8;
* see item 8 for more information about when to change the idacval parameter):
* 1) get the ground current value for your design from the .meas statement, and
* list it in mA with 4 decimal places of precision (the lower, the better); you should
* only report the ground current value for when the idacval parameter is set to zero
* (see item 8 for more information about when to change the idacval parameter)
* 2) view the spice error log and ensure that all of your devices are in the proper
* operating mode -- most devices should be in saturation/active mode, but there
* will be some exceptions, e.g., the triode resistor devices; note that one or both
* of your class AB output devices may (or may not) be in subthreshold mode: if
* so, and you think this is problematic for your design and you don't know how to
* resolve the issue, let me know (idacval should be zero for this)
* 3) get the quiescent current values for your NMOS and PMOS class AB output
* devices M1out and M2out, respectively, in the 0 V ammeters V2 and V3; report
* the .meas statement values for iqn and iqp in mA with four decimal places of
* precision; your measured values should be very close to your target IQ value
* (idacval should be zero for this)
* 4) verify that vout is very near the common-mode voltage of VDD/2=1.65V; use
* the .meas statement value of voutmeas and report what you get with 4 decimal
* places of precision (e.g., 1.6493 V is "very near," whereas, e.g., 1.5478 V is not)
* (idacval should be zero for this)
* 5) verify that the output offset current I(V7) is very low (ideally, zero); use the
* .meas statement value of ioffset and report what you get with 4 decimal places
* of precision in proper engineering notation format (idacval should be zero for this)
* 6) get the gm values of floating current mirror (FCM) devices M3fcm and M4fcm
* from the spice error log and ensure they match "well"; note that the gm values
* of these two devices may not match as well as the gm values of M6fcmR and
* M8fcmR; you will need to come to some conclusions about how well the gm
* values of M3fcm and M4fcm need to match for this particular application
* (idacval should be zero for this)
* 7) get the resistance values R1c and R2c, where Rc=1/gds, of the two triode
* device resistors M1c and M2c from the spice error log (idacval should be zero
* for this)
* 8) all of the items above should have the idacval parameter set to zero; to verify
* that your devices remain in saturation when the output makes its maximum
* positive and negative excursions, set the idacval parameter to {i1*idacunitval}
* and {-i1*idacunitval}, respectively, and check the spice error log; there are some
* devices that won't be in saturation, so be sure you know which ones those are
* (e.g., see item 2 above)
* feedback network filter symbol
* IDAC (current-steering digital-to-analog converter)
.backanno
.end